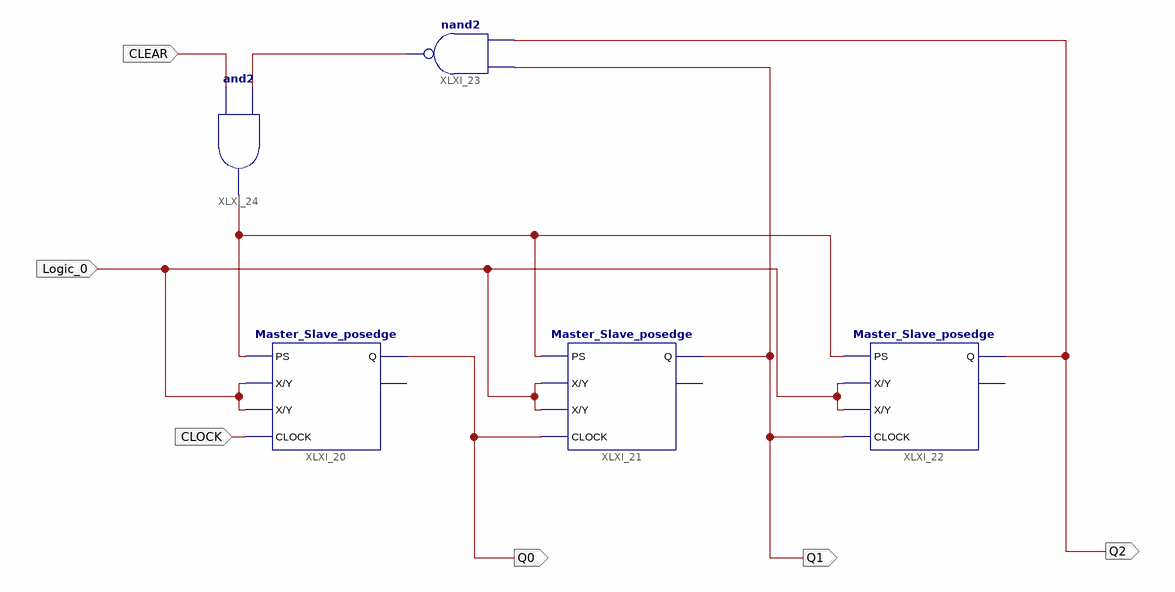
[diagram p0: schematic sheet 1]
// Xilinx ISE schematic MOD_6_DOWN_COUNTER.sch (artix7) as structural Verilog: 5 symbols, 6 ports
module MOD_6_DOWN_COUNTER (
  input  Logic_0,
  input  CLOCK,
  input  CLEAR,
  output Q0,
  output Q1,
  output Q2
);

  wire XLXN_34, XLXN_38;

  Master_Slave_posedge XLXI_20 (.CLOCK(CLOCK), .PS(XLXN_38), .Q(Q0), .X(Logic_0), .Y(Logic_0));  // open: Qb
  Master_Slave_posedge XLXI_21 (.CLOCK(Q0), .PS(XLXN_38), .Q(Q1), .X(Logic_0), .Y(Logic_0));  // open: Qb
  Master_Slave_posedge XLXI_22 (.CLOCK(Q1), .PS(XLXN_38), .Q(Q2), .X(Logic_0), .Y(Logic_0));  // open: Qb
  nand XLXI_23 (XLXN_34, Q2, Q1);
  and XLXI_24 (XLXN_38, CLEAR, XLXN_34);
endmodule
